# Altium schematic sheet USB.SchDoc
size A; SheetNumber: 3; SheetTotal: 5
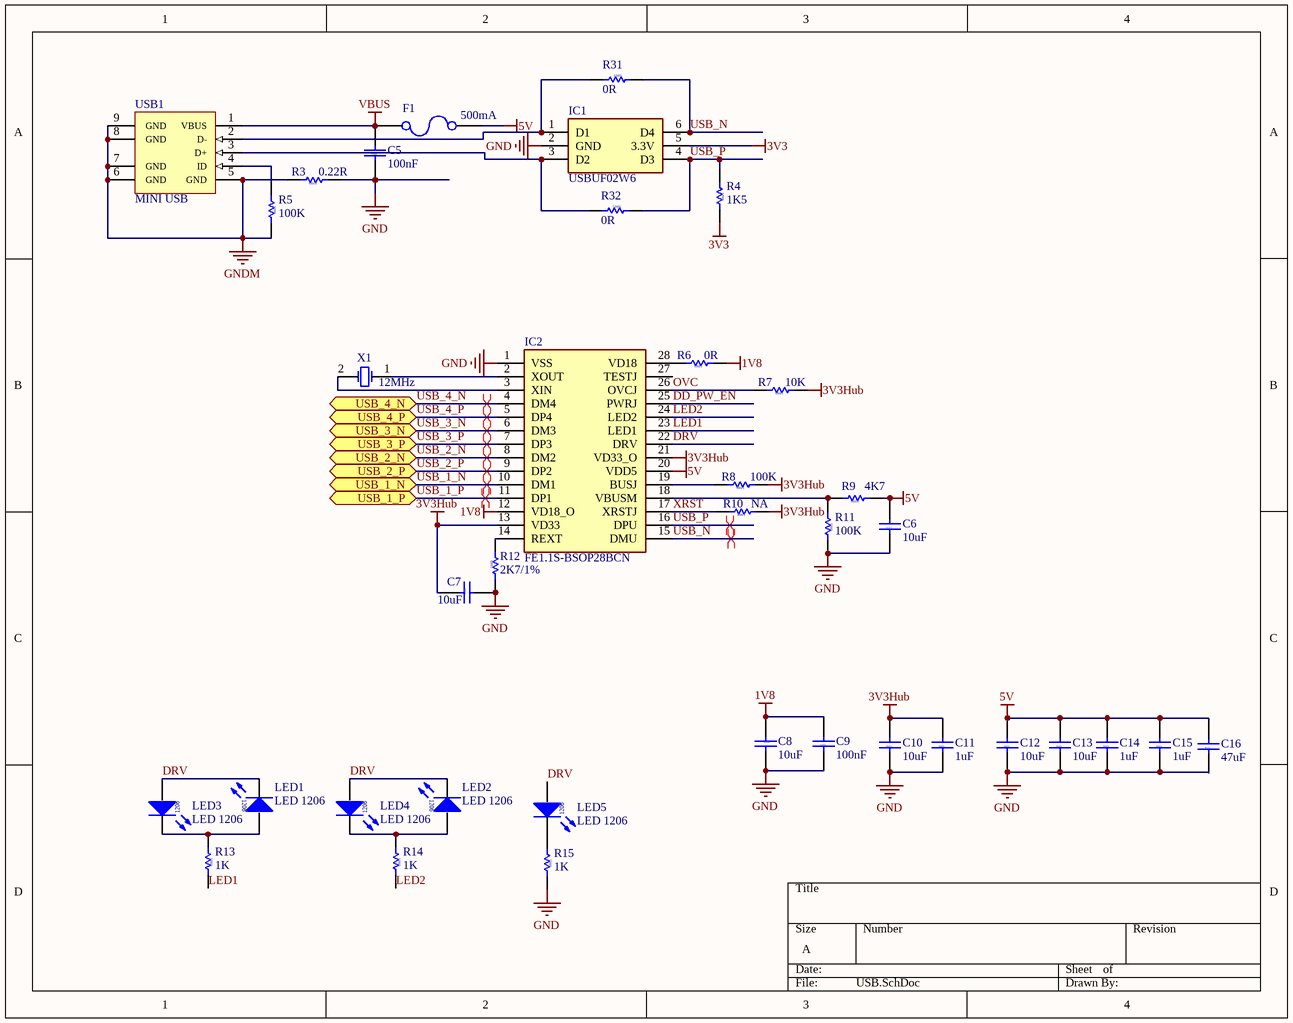
[diagram p0: USB.SchDoc]

## Parts
C5  100nF  [RES 0805]
C6  10uF  [Res 1206]
C7  10uF  [Res 1206]
C8  10uF  [Res 1206]
C9  100nF  [RES 0805]
C10  10uF  [Res 1206]
C11  1uF  [Res 1206]
C12  10uF  [Res 1206]
C13  10uF  [Res 1206]
C14  1uF  [Res 1206]
C15  1uF  [Res 1206]
C16  47uF  [Res 1206]
F1  500mA  [Res 1206]
IC1  USBUF02W6  [SOT65P210X110-6N]
IC2  FE1.1S-BSOP28BCN  [SOP64P600X175-28N]
LED1  LED 1206  [LED 1206]
LED2  LED 1206  [LED 1206]
LED3  LED 1206  [LED 1206]
LED4  LED 1206  [LED 1206]
LED5  LED 1206  [LED 1206]
R3  0.22R  [RES 0805]
R4  1K5  [RES 0805]
R5  100K  [RES 0805]
R6  0R  [RES 0805]
R7  10K  [RES 0805]
R8  100K  [RES 0805]
R9  4K7  [RES 0805]
R10  NA  [RES 0805]
R11  100K  [RES 0805]
R12  2K7/1%  [RES 0805]
R13  1K  [RES 0805]
R14  1K  [RES 0805]
R15  1K  [RES 0805]
R31  0R  [RES 0805]
R32  0R  [RES 0805]
USB1  MINI USB  [USB MINI DIP]
X1  12MHz  [XTAL - SMD]

## Ports
USB_1_N (bidir), USB_1_P (bidir), USB_2_N (bidir), USB_2_P (bidir), USB_3_N (bidir), USB_3_P (bidir), USB_4_N (bidir), USB_4_P (bidir)

## Nets
1V8: C8.1 C9.2 IC2.12(VD18_O) R6.1
3V3: IC1.5(3.3V) R4.2
3V3Hub: C7.1 C10.2 C11.2 IC2.13(VD33) IC2.21(VD33_O) R7.1 R8.1 R10.1
5V: C6.2 C12.2 C13.2 C14.2 C15.2 C16.2 F1.2 IC2.20(VDD5) R9.1
GND: C5.1 C6.1 C7.2 C8.2 C9.1 C10.1 C11.1 C12.1 C13.1 C14.1 C15.1 C16.1 IC1.2(GND) IC2.1(VSS) R3.1 R11.2 R12.1 R15.2
GNDM: R3.2 R5.2 USB1.5(GND) USB1.6(GND) USB1.7(GND) USB1.8(GND) USB1.9(GND)
VBUS: C5.2 F1.1 USB1.1(VBUS)
DD_PW_EN: IC2.25(PWRJ)
DRV: IC2.22(DRV) LED1.2(K) LED2.2(K) LED3.1(A) LED4.1(A) LED5.1(A)
LED1: IC2.23(LED1) R13.2
LED2: IC2.24(LED2) R14.2
OVC: IC2.26(OVCJ) R7.2
USB_1_N: IC2.10(DM1) ; port USB_1_N
USB_1_P: IC2.11(DP1) ; port USB_1_P
USB_2_N: IC2.8(DM2) ; port USB_2_N
USB_2_P: IC2.9(DP2) ; port USB_2_P
USB_3_N: IC2.6(DM3) ; port USB_3_N
USB_3_P: IC2.7(DP3) ; port USB_3_P
USB_4_N: IC2.4(DM4) ; port USB_4_N
USB_4_P: IC2.5(DP4) ; port USB_4_P
USB_N: IC1.6(D4) IC2.15(DMU) R31.2
USB_P: IC1.4(D3) IC2.16(DPU) R4.1 R32.2
XRST: IC2.17(XRSTJ) R10.2
NetIC1_1: IC1.1(D1) R31.1 USB1.2(D-)
NetIC1_3: IC1.3(D2) R32.1 USB1.3(D+)
NetIC2_2: IC2.2(XOUT) X1.1(OSC1)
NetIC2_3: IC2.3(XIN) X1.2(OSC2)
NetIC2_14: IC2.14(REXT) R12.2
NetIC2_18: IC2.18(VBUSM) R9.2 R11.1
NetIC2_19: IC2.19(BUSJ) R8.2
NetIC2_28: IC2.28(VD18) R6.2
NetLED1_1: LED1.1(A) LED3.2(K) R13.1
NetLED2_1: LED2.1(A) LED4.2(K) R14.1
NetLED5_2: LED5.2(K) R15.1
NetR5_1: R5.1 USB1.4(ID)

Not connected (* = marked no-connect by the designer): IC2 27(TESTJ)

## Layout directives
differential pair: USB_1_N, USB_1_P, USB_2_N, USB_2_P, USB_3_N, USB_3_P, USB_4_N, USB_4_P, USB_N, USB_P

## Notes on the sheet
- (in symbol CAP 0805) 0805
- (in symbol CAP 1206) 1206
- (in symbol LED 1206) 1206
- (in symbol RES 0805) 0805

## Library data of the parts
C5 C9 = CAP 0805
C6-C8 C10-C16 = CAP 1206
F1 = FUSE 1206
IC1 = USBUF02W6: Integrated Circuit; Manufacturer_Name: STMicroelectronics; Datasheet Link: http://www.st.com/web/en/resource/technical/document/datasheet/CD00002046.pdf; Height: 1.1mm; Manufacturer_Part_Number: USBUF02W6; Mouser Part Number: 511-USBUF02W6; Mouser Price/Stock: https://www.mouser.co.uk/ProductDetail/STMicroelectronics/USBUF02W6?qs=po45yt2pPpsSshudxXreiQ%3D%3D; Arrow Part Number: USBUF02W6; Arrow Price/Stock: https://www.arrow.com/en/products/usbuf02w6/stmicroelectronics?region=nac
IC2 = FE1.1S-BSOP28BCN: Integrated Circuit; Manufacturer_Name: Terminus Technology; Datasheet Link: https://datasheet.lcsc.com/lcsc/1811021220_Terminus-Tech-FE1-1S-BSOP28BCN_C9359.pdf; Height: 1.75mm; Manufacturer_Part_Number: FE1.1S-BSOP28BCN
R3-R9 R11-R15 R31 R32 = RES 0805
R10 = RES 0805: 100K
USB1 = USB MINI DIP
X1 = XTAL - SMD